# EAGLE schematic stamp-control (EAGLE 5.12)

## Sheet 1 of 2
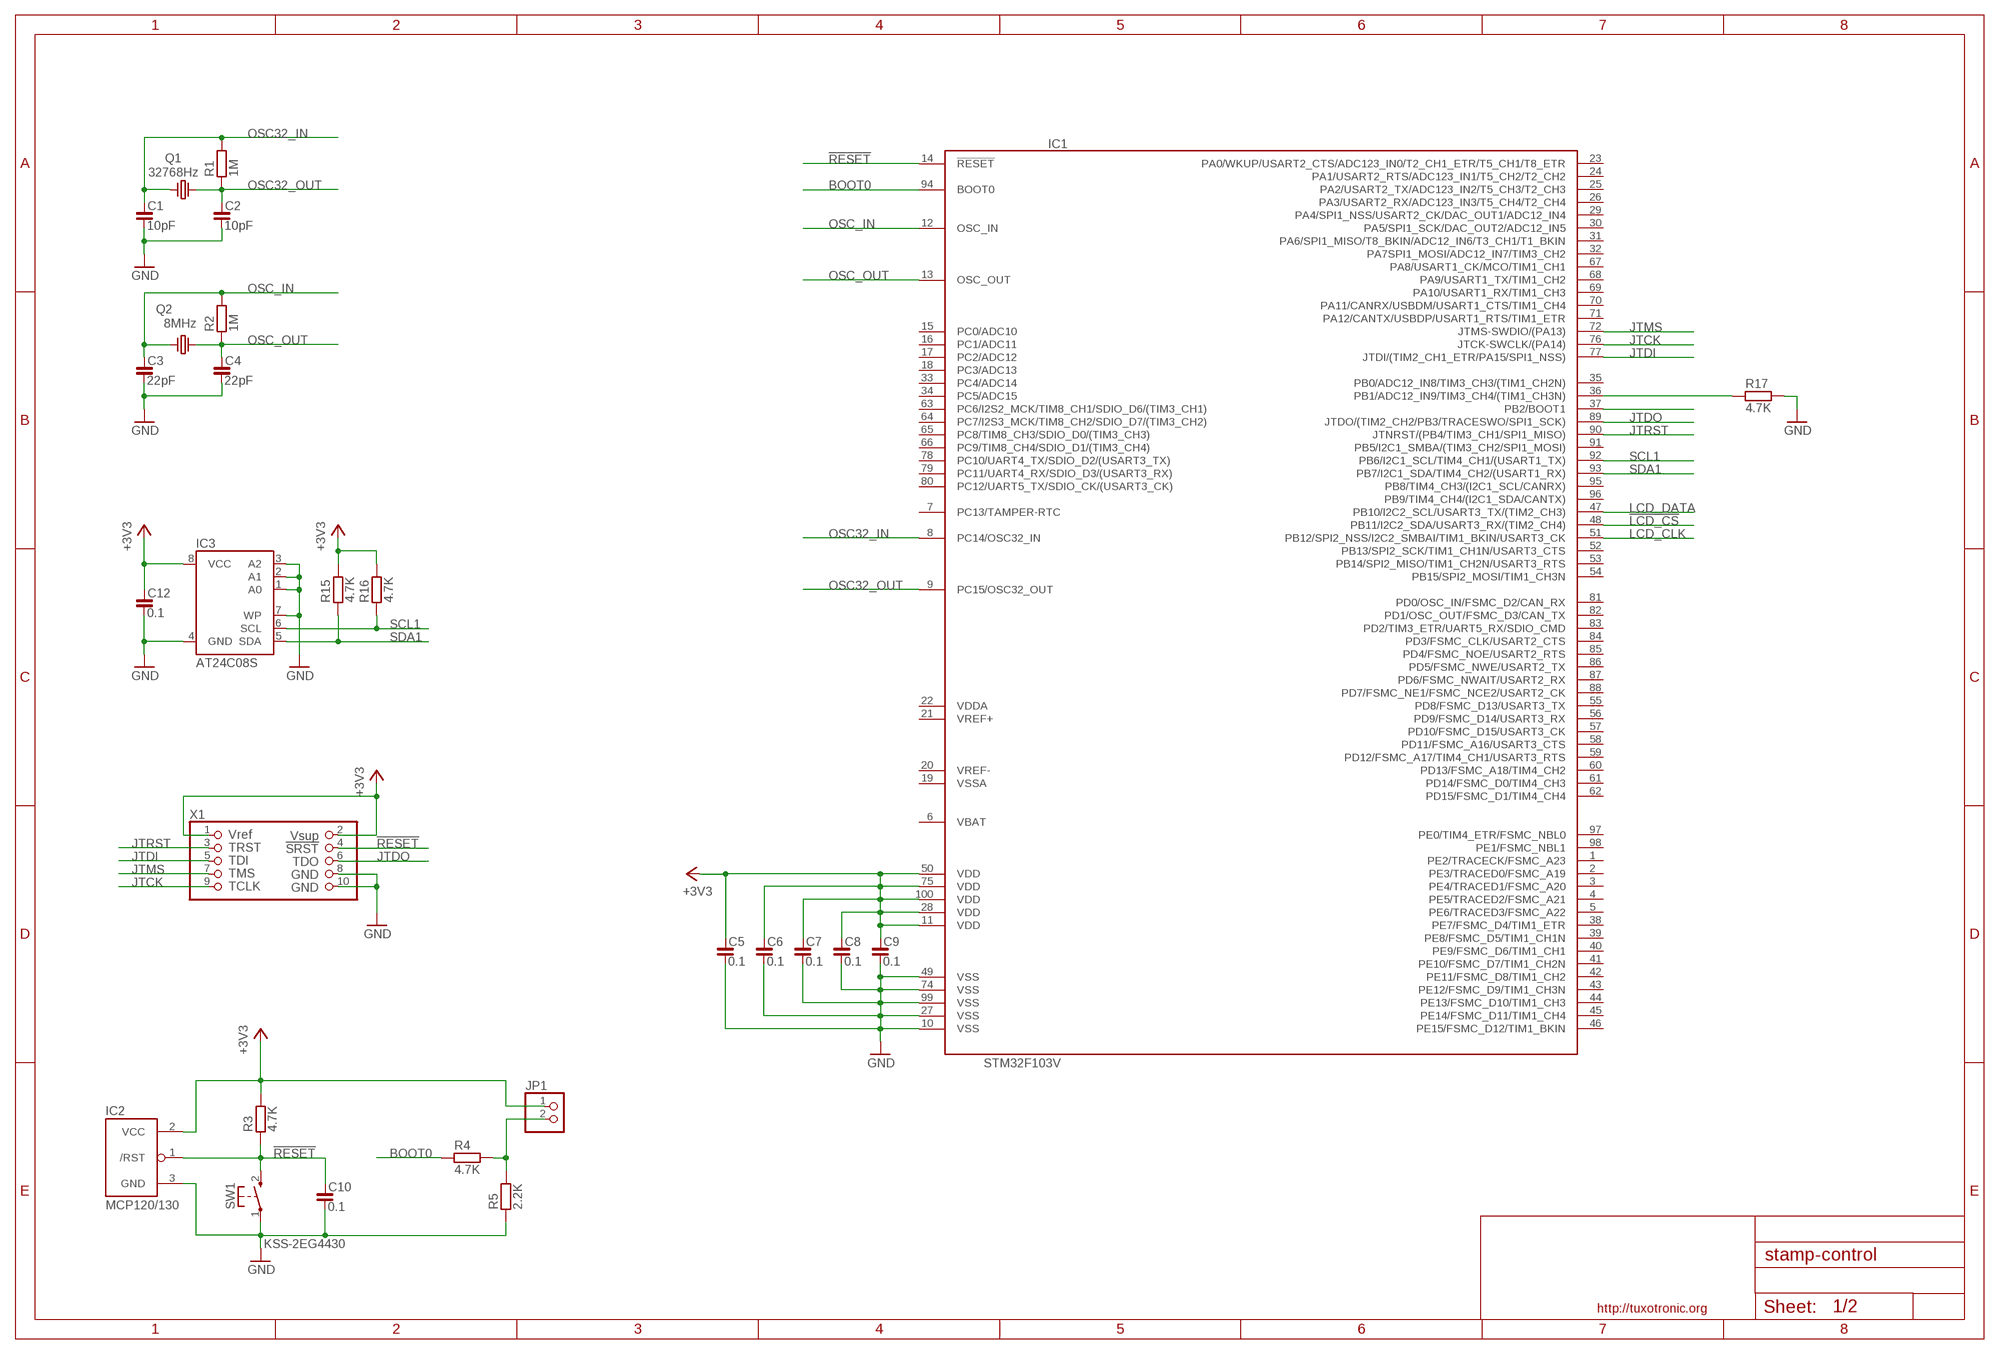
[diagram p0: schematic, sheet 1]

### Parts
C1  10pF  C_0603  [C0603]
C2  10pF  C_0603  [C0603]
C3  22pF  C_0603  [C0603]
C4  22pF  C_0603  [C0603]
C5  0.1  C_0603  [C0603]
C6  0.1  C_0603  [C0603]
C7  0.1  C_0603  [C0603]
C8  0.1  C_0603  [C0603]
C9  0.1  C_0603  [C0603]
C10  0.1  C_0603  [C0603]
C12  0.1  C_0603  [C0603]
IC1  STM32F103V  [TQFP100]
IC2  MCP120/130  [SOT23]
IC3  AT24C08S  AT24C256S  [SO08]
JP1  PINHD-1X2_2.00  [1X02M]
Q1  32768Hz  CRYSTAL-TC26H  [TC26H]
Q2  8MHz  CRYSTAL-HC49S  [HC49/S]
R1  1M  R_0603  [R0603]
R2  1M  R_0603  [R0603]
R3  4.7K  R_0603  [R0603]
R4  4.7K  R_0603  [R0603]
R5  2.2K  R_0603  [R0603]
R15  4.7K  R_0603  [R0603]
R16  4.7K  R_0603  [R0603]
R17  4.7K  R_0603  [R0603]
SW1  KSS-2EG4430  [KSS-2EG4430]
X1  JTAG_JTAG10_2.00  [JTAG_2X05M-JTAG]

### Nets
!LCD_CS: IC1.48(PB11/I2C2_SDA/USART3_RX/(TIM2_CH4)) ; also sheet 2
!RESET: C10.1 IC1.14(!RESET) IC2.1(/RST) R3.1 SW1.2(S) X1.4 ; also sheet 2
+3V3: C5.1 C6.1 C7.1 C8.1 C9.1 C12.1 IC1.11(VDD) IC1.28(VDD) IC1.50(VDD) IC1.75(VDD) IC1.100(VDD) IC2.2(VCC) IC3.8(VCC) JP1.1 R3.2 R15.2 R16.2 X1.1 X1.2 ; also sheet 2
BOOT0: IC1.94(BOOT0) R4.1
GND: C1.2 C2.2 C3.2 C4.2 C5.2 C6.2 C7.2 C8.2 C9.2 C10.2 C12.2 IC1.10(VSS) IC1.27(VSS) IC1.49(VSS) IC1.74(VSS) IC1.99(VSS) IC2.3(GND) IC3.1(A0) IC3.2(A1) IC3.3(A2) IC3.4(GND) IC3.7(WP) R5.1 R17.2 SW1.1(P) X1.8 X1.10 ; also sheet 2
JTCK: IC1.76(JTCK-SWCLK/(PA14)) X1.9
JTDI: IC1.77(JTDI/(TIM2_CH1_ETR/PA15/SPI1_NSS)) X1.5
JTDO: IC1.89(JTDO/(TIM2_CH2/PB3/TRACESWO/SPI1_SCK)) X1.6
JTMS: IC1.72(JTMS-SWDIO/(PA13)) X1.7
JTRST: IC1.90(JTNRST/(PB4/TIM3_CH1/SPI1_MISO)) X1.3
LCD_CLK: IC1.51(PB12/SPI2_NSS/I2C2_SMBAI/TIM1_BKIN/USART3_CK) ; also sheet 2
LCD_DATA: IC1.47(PB10/I2C2_SCL/USART3_TX/(TIM2_CH3)) ; also sheet 2
N$5: JP1.2 R4.2 R5.2
N$10: IC1.37(PB2/BOOT1)
N$11: IC1.36(PB1/ADC12_IN9/TIM3_CH4/(TIM1_CH3N)) R17.1
OSC32_IN: C1.1 IC1.8(PC14/OSC32_IN) Q1.1 R1.2
OSC32_OUT: C2.1 IC1.9(PC15/OSC32_OUT) Q1.2 R1.1
OSC_IN: C3.1 IC1.12(OSC_IN) Q2.1 R2.2
OSC_OUT: C4.1 IC1.13(OSC_OUT) Q2.2 R2.1
SCL1: IC1.92(PB6/I2C1_SCL/TIM4_CH1/(USART1_TX)) IC3.6(SCL) R16.1
SDA1: IC1.93(PB7/I2C1_SDA/TIM4_CH2/(USART1_RX)) IC3.5(SDA) R15.1
Unconnected: IC1.1(PE2/TRACECK/FSMC_A23) IC1.2(PE3/TRACED0/FSMC_A19) IC1.3(PE4/TRACED1/FSMC_A20) IC1.4(PE5/TRACED2/FSMC_A21) IC1.5(PE6/TRACED3/FSMC_A22) IC1.7(PC13/TAMPER-RTC) IC1.15(PC0/ADC10) IC1.16(PC1/ADC11) IC1.17(PC2/ADC12) IC1.18(PC3/ADC13) IC1.23(PA0/WKUP/USART2_CTS/ADC123_IN0/T2_CH1_ETR/T5_CH1/T8_ETR) IC1.24(PA1/USART2_RTS/ADC123_IN1/T5_CH2/T2_CH2) IC1.25(PA2/USART2_TX/ADC123_IN2/T5_CH3/T2_CH3) IC1.26(PA3/USART2_RX/ADC123_IN3/T5_CH4/T2_CH4) IC1.29(PA4/SPI1_NSS/USART2_CK/DAC_OUT1/ADC12_IN4) IC1.30(PA5/SPI1_SCK/DAC_OUT2/ADC12_IN5) IC1.31(PA6/SPI1_MISO/T8_BKIN/ADC12_IN6/T3_CH1/T1_BKIN) IC1.32(PA7SPI1_MOSI/ADC12_IN7/TIM3_CH2) IC1.33(PC4/ADC14) IC1.34(PC5/ADC15) IC1.35(PB0/ADC12_IN8/TIM3_CH3/(TIM1_CH2N)) IC1.38(PE7/FSMC_D4/TIM1_ETR) IC1.39(PE8/FSMC_D5/TIM1_CH1N) IC1.40(PE9/FSMC_D6/TIM1_CH1) IC1.41(PE10/FSMC_D7/TIM1_CH2N) IC1.42(PE11/FSMC_D8/TIM1_CH2) IC1.43(PE12/FSMC_D9/TIM1_CH3N) IC1.44(PE13/FSMC_D10/TIM1_CH3) IC1.45(PE14/FSMC_D11/TIM1_CH4) IC1.46(PE15/FSMC_D12/TIM1_BKIN) IC1.52(PB13/SPI2_SCK/TIM1_CH1N/USART3_CTS) IC1.53(PB14/SPI2_MISO/TIM1_CH2N/USART3_RTS) IC1.54(PB15/SPI2_MOSI/TIM1_CH3N) IC1.55(PD8/FSMC_D13/USART3_TX) IC1.56(PD9/FSMC_D14/USART3_RX) IC1.57(PD10/FSMC_D15/USART3_CK) IC1.58(PD11/FSMC_A16/USART3_CTS) IC1.59(PD12/FSMC_A17/TIM4_CH1/USART3_RTS) IC1.60(PD13/FSMC_A18/TIM4_CH2) IC1.61(PD14/FSMC_D0/TIM4_CH3) IC1.62(PD15/FSMC_D1/TIM4_CH4) IC1.63(PC6/I2S2_MCK/TIM8_CH1/SDIO_D6/(TIM3_CH1)) IC1.64(PC7/I2S3_MCK/TIM8_CH2/SDIO_D7/(TIM3_CH2)) IC1.65(PC8/TIM8_CH3/SDIO_D0/(TIM3_CH3)) IC1.66(PC9/TIM8_CH4/SDIO_D1/(TIM3_CH4)) IC1.67(PA8/USART1_CK/MCO/TIM1_CH1) IC1.68(PA9/USART1_TX/TIM1_CH2) IC1.69(PA10/USART1_RX/TIM1_CH3) IC1.70(PA11/CANRX/USBDM/USART1_CTS/TIM1_CH4) IC1.71(PA12/CANTX/USBDP/USART1_RTS/TIM1_ETR) IC1.78(PC10/UART4_TX/SDIO_D2/(USART3_TX)) IC1.79(PC11/UART4_RX/SDIO_D3/(USART3_RX)) IC1.80(PC12/UART5_TX/SDIO_CK/(USART3_CK)) IC1.81(PD0/OSC_IN/FSMC_D2/CAN_RX) IC1.82(PD1/OSC_OUT/FSMC_D3/CAN_TX) IC1.83(PD2/TIM3_ETR/UART5_RX/SDIO_CMD) IC1.84(PD3/FSMC_CLK/USART2_CTS) IC1.85(PD4/FSMC_NOE/USART2_RTS) IC1.86(PD5/FSMC_NWE/USART2_TX) IC1.87(PD6/FSMC_NWAIT/USART2_RX) IC1.88(PD7/FSMC_NE1/FSMC_NCE2/USART2_CK) IC1.91(PB5/I2C1_SMBA/(TIM3_CH2/SPI1_MOSI)) IC1.95(PB8/TIM4_CH3/(I2C1_SCL/CANRX)) IC1.96(PB9/TIM4_CH4/(I2C1_SDA/CANTX)) IC1.97(PE0/TIM4_ETR/FSMC_NBL0) IC1.98(PE1/FSMC_NBL1)

## Sheet 2 of 2
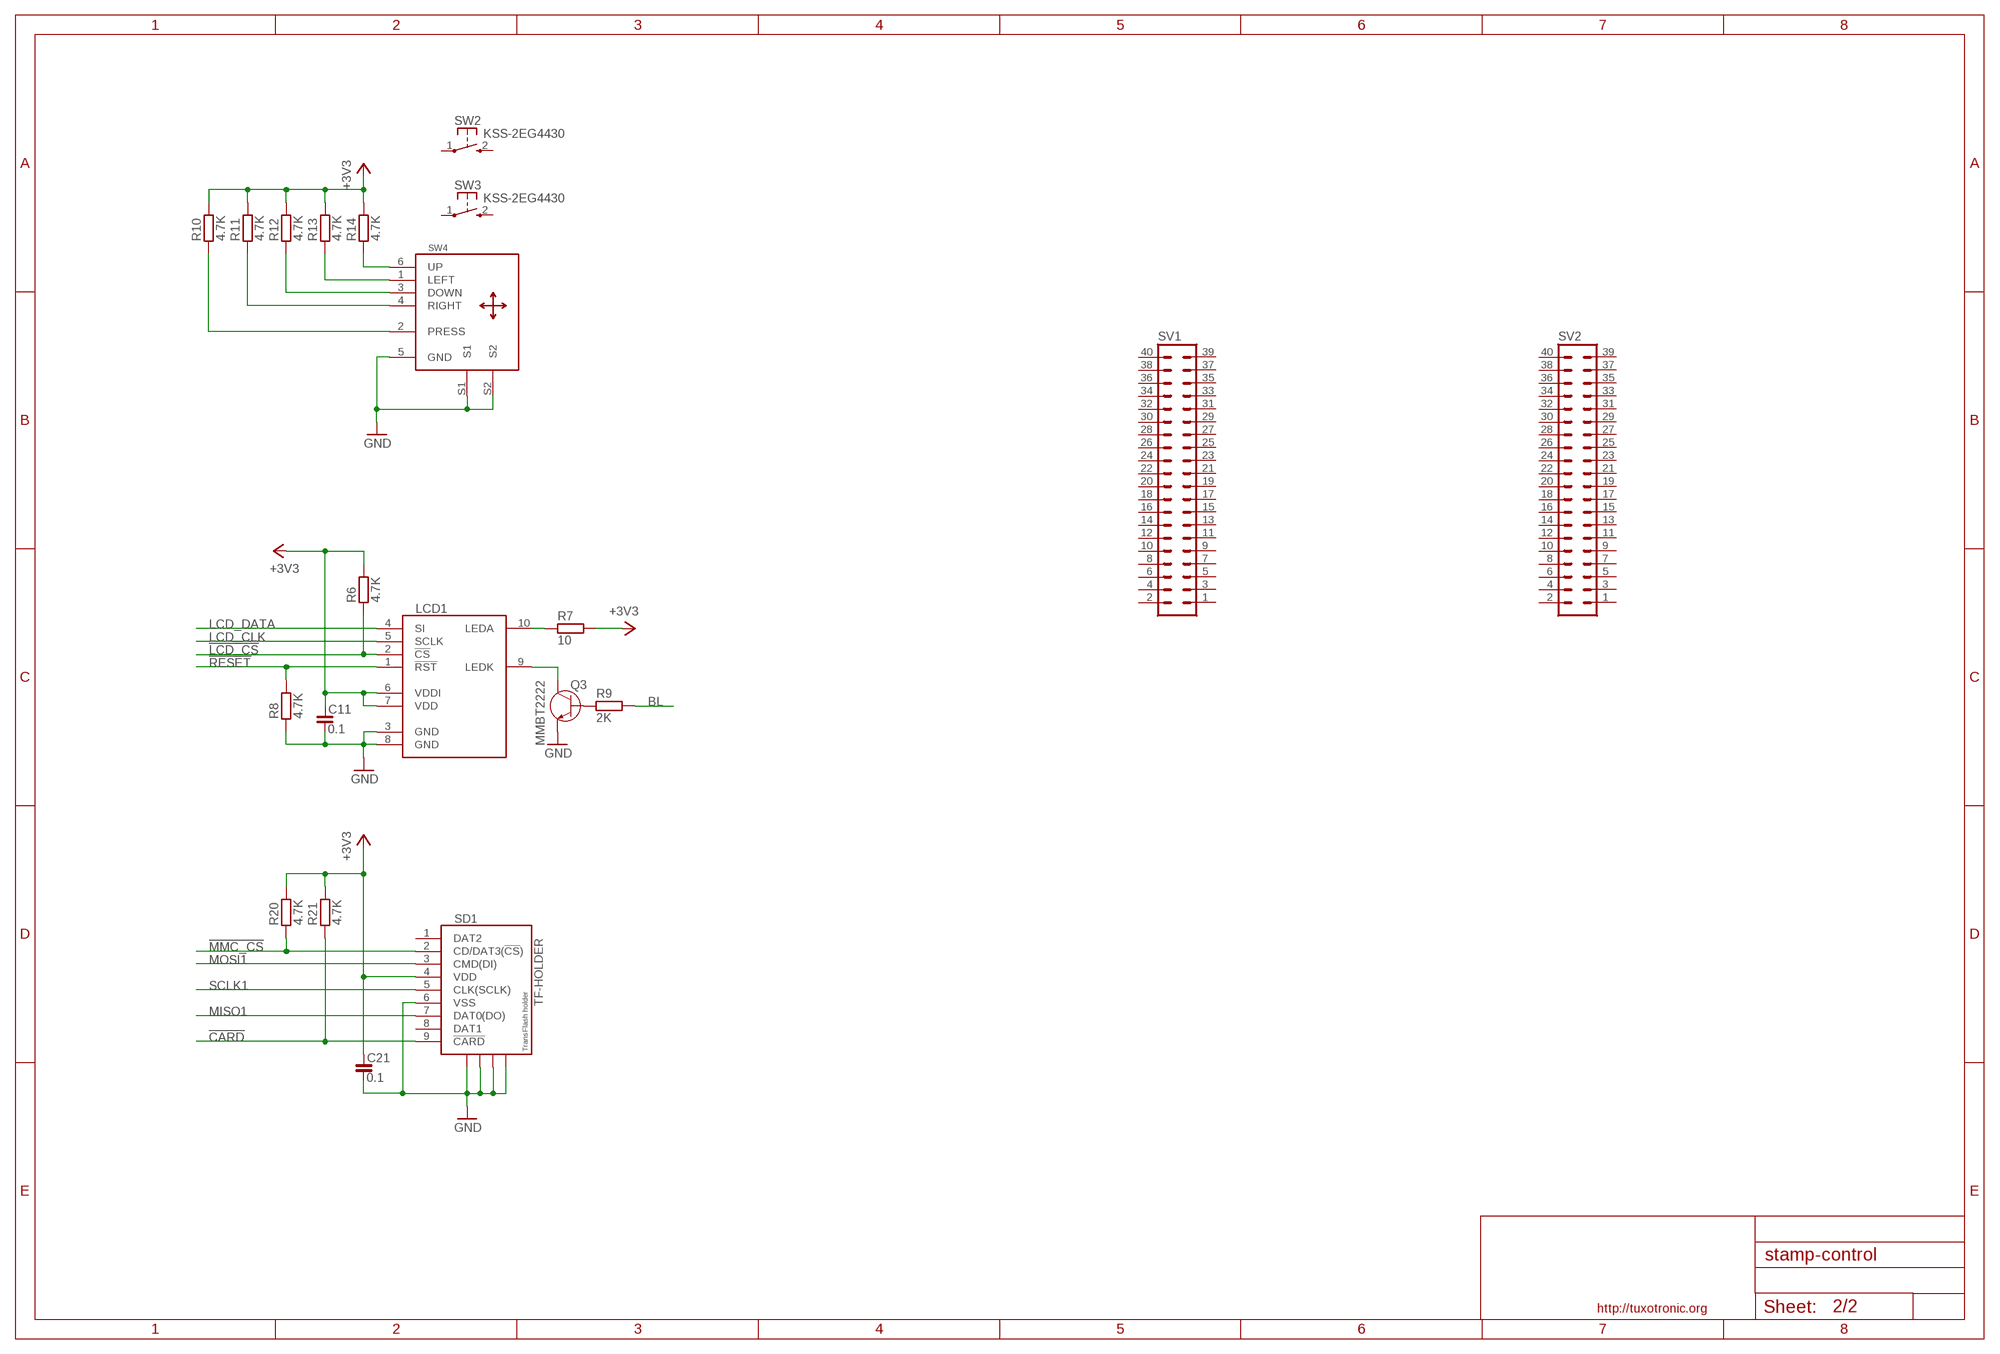
[diagram p1: schematic, sheet 2]

### Parts
C11  0.1  C_0603  [C0603]
C21  0.1  C_0603  [C0603]
LCD1  LCD1202-EXT  [NOKIA1202LCD-EXT]
Q3  MMBT2222  [SOT23]
R6  4.7K  R_0603  [R0603]
R7  10  R_0603  [R0603]
R8  4.7K  R_0603  [R0603]
R9  2K  R_0603  [R0603]
R10  4.7K  R_0603  [R0603]
R11  4.7K  R_0603  [R0603]
R12  4.7K  R_0603  [R0603]
R13  4.7K  R_0603  [R0603]
R14  4.7K  R_0603  [R0603]
R20  4.7K  R_0603  [R0603]
R21  4.7K  R_0603  [R0603]
SD1  TF-HOLDER  [TF-PULL]
SV1  MA20-2  [MA20-2]
SV2  MA20-2  [MA20-2]
SW2  KSS-2EG4430  [KSS-2EG4430]
SW3  KSS-2EG4430  [KSS-2EG4430]
SW4  NOKIA-JOY  [NOKIA_JOY]

### Nets
!CARD: R21.1 SD1.9(!CARD)
!LCD_CS: LCD1.2(!CS) R6.1 ; also sheet 1
!MMC_CS: R20.1 SD1.2(CD/DAT3(!CS!))
!RESET: LCD1.1(!RST) R8.2 ; also sheet 1
+3V3: C11.1 C21.1 LCD1.6(VDDI) LCD1.7(VDD) R6.2 R7.2 R10.2 R11.2 R12.2 R13.2 R14.2 R20.2 R21.2 SD1.4(VDD) ; also sheet 1
BL: R9.2
GND: C11.2 C21.2 LCD1.3(GND) LCD1.8(GND) Q3.2(E) R8.1 SD1.6(VSS) SD1.S1 SD1.S2 SD1.S3 SD1.S4 SW4.5(GND) SW4.S1 SW4.S2 ; also sheet 1
LCD_CLK: LCD1.5(SCLK) ; also sheet 1
LCD_DATA: LCD1.4(SI) ; also sheet 1
MISO1: SD1.7(DAT0(DO))
MOSI1: SD1.3(CMD(DI))
N$1: Q3.1(B) R9.1
N$2: R10.1 SW4.2(PRESS)
N$3: R11.1 SW4.4(RIGHT)
N$4: R12.1 SW4.3(DOWN)
N$6: R13.1 SW4.1(LEFT)
N$7: LCD1.9(LEDK) Q3.3(C)
N$8: LCD1.10(LEDA) R7.1
N$9: R14.1 SW4.6(UP)
SCLK1: SD1.5(CLK(SCLK))
Unconnected: SD1.1(DAT2) SD1.8(DAT1) SV1.1 SV1.2 SV1.3 SV1.4 SV1.5 SV1.6 SV1.7 SV1.8 SV1.9 SV1.10 SV1.11 SV1.12 SV1.13 SV1.14 SV1.15 SV1.16 SV1.17 SV1.18 SV1.19 SV1.20 SV1.21 SV1.22 SV1.23 SV1.24 SV1.25 SV1.26 SV1.27 SV1.28 SV1.29 SV1.30 SV1.31 SV1.32 SV1.33 SV1.34 SV1.35 SV1.36 SV1.37 SV1.38 SV1.39 SV1.40 SV2.1 SV2.2 SV2.3 SV2.4 SV2.5 SV2.6 SV2.7 SV2.8 SV2.9 SV2.10 SV2.11 SV2.12 SV2.13 SV2.14 SV2.15 SV2.16 SV2.17 SV2.18 SV2.19 SV2.20 SV2.21 SV2.22 SV2.23 SV2.24 SV2.25 SV2.26 SV2.27 SV2.28 SV2.29 SV2.30 SV2.31 SV2.32 SV2.33 SV2.34 SV2.35 SV2.36 SV2.37 SV2.38 SV2.39 SV2.40 SW2.1(P) SW2.2(S) SW3.1(P) SW3.2(S)

## Power pins joined to a net without a drawn wire
VBAT: IC1.6(VBAT)
VDDA: IC1.22(VDDA)
VREF+: IC1.21(VREF+)
VREF-: IC1.20(VREF-)
VSSA: IC1.19(VSSA)

## Library data of the parts
C1-C12 C21 = rc-master-smd:C_: NON-POLARIZED CAP
IC1 = stm32:STM32F103V: Cortex-M3 STM32F103V LQFP-100
IC2 = mcp120-130:MCP120/130
IC3 = stm32-by-pb:AT24C*: 2-wire serial EEPROM
JP1 = pinhead-fixdrills:PINHD-1X2: PIN HEADER
LCD1 = lcd1202:LCD1202: 1.3" b/w graphics display 96x68 pixel. From Nokia 1202 cell phone
Q1 Q2 = discrete:CRYSTAL-: CRYSTAL
Q3 = semiconductor:MMBT2222: General Purpose Transistors NPN Silicon Rating MMBT2222LT1G MMBT2222ALT1G Collector-Emitter Voltage (VCEO) 30 Vdc 40 Vdc Collector-Base Voltage (VCBO) 60 Vdc 75 Vdc Emitter-Base Voltage (VEBO) 5.0 Vdc 6.0 Vdc Collector Current Continuous (IC) 600 mAdc 1100 mAdc Collector Current Peak (ICM) 600 mAdc 1100 mAdc
R1-R17 R20 R21 = rc-master-smd:R_: RESISTOR
SD1 = sd-mmc:TF-HOLDER: TF / Micro SD socket is PUSH-PUSH type, the card can be pushed into and auto locked and pushed out by simply press the card. Surface Mounting type.
SV1 SV2 = con-lstb:MA20-2: PIN HEADER
SW1-SW3 = buttons:KSS-2EG4430: Size: 3x6mm Height: 5mm from PCB Rating: DC12v 50mA Travel: 0.25±0.10mm Operating Force: 180±50gf Return Force: 60gf min Contact resistance: 100m? max Insulation resistance: 100M? min Operating life?50,000 cycles
SW4 = buttons:NOKIA-JOY: Nokia 3250/6820/N73 Joystick
X1 = stm32:JTAG_JTAG10: 10 pin JTAG connector Chinese adapter

## Net classes
0 default: width 0.1 mm, drill 0.1 mm, clearance 0.1 mm